# Altium schematic sheet altium_import_netname.SchDoc
size A4
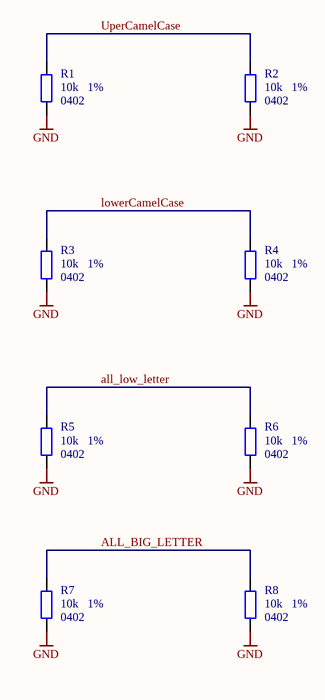
[diagram p0: altium_import_netname.SchDoc]

## Parts
R1  tolerance: 1%  package: 0402  [CRCW0402]  (hidden comment: 10k)
R2  tolerance: 1%  package: 0402  [CRCW0402]  (hidden comment: 10k)
R3  tolerance: 1%  package: 0402  [CRCW0402]  (hidden comment: 10k)
R4  tolerance: 1%  package: 0402  [CRCW0402]  (hidden comment: 10k)
R5  tolerance: 1%  package: 0402  [CRCW0402]  (hidden comment: 10k)
R6  tolerance: 1%  package: 0402  [CRCW0402]  (hidden comment: 10k)
R7  tolerance: 1%  package: 0402  [CRCW0402]  (hidden comment: 10k)
R8  tolerance: 1%  package: 0402  [CRCW0402]  (hidden comment: 10k)

## Nets
GND: R1.1 R2.1 R3.1 R4.1 R5.1 R6.1 R7.1 R8.1
ALL_BIG_LETTER: R7.2 R8.2
all_low_letter: R5.2 R6.2
lowerCamelCase: R3.2 R4.2
UperCamelCase: R1.2 R2.2

## Library data of the parts
R1-R8 = CRCW040210K0FKED: 0.063W, 0402, 1%, 10k, 50 V; Manufacturer: Vishay; voltage: 50 V; Certification: AEC-Q200; Manufacturer Bezeichnung: CRCW040210K0FKED; power: 0.063W; Supplier 1: Mouser; Supplier Part Number 1: 71-CRCW0402-10K-E3; Supplier 2: Digi-Key; Supplier Part Number 2: 541-10.0KLCT-ND; value: 10k